# EAGLE design grid1-4 (EAGLE 6.6.0)
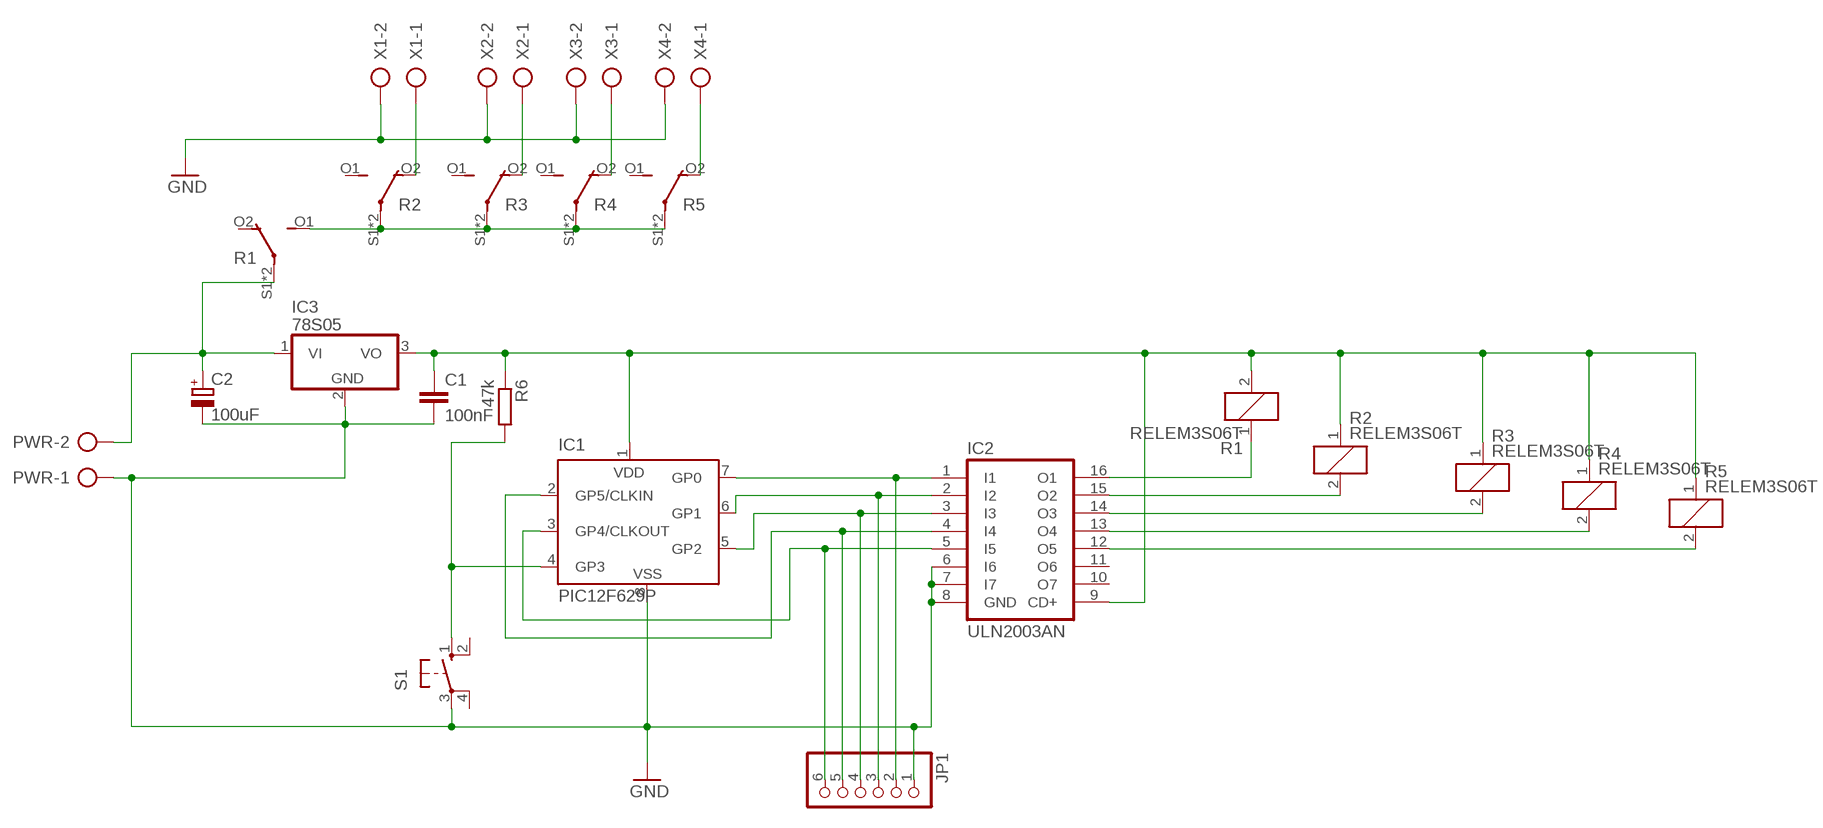
[diagram p0: schematic, sheet 1]

## Parts
C1  100nF  C-EU050-025X075  [C050-025X075]
C2  100uF  CPOL-EUE2.5-6  [E2,5-6]
IC1  PIC12F629P  [DIL8]
IC2  ULN2003AN  [DIL16]
IC3  78S05  7805TV  [TO220V]
JP1  PINHD-1X6  [1X06]
PWR  AK500/2  [AK500/2]
R1  RELEM3S06T  [VIGAN]
R2  RELEM3S06T  [VIGAN]
R3  RELEM3S06T  [VIGAN]
R4  RELEM3S06T  [VIGAN]
R5  RELEM3S06T  [VIGAN]
R6  47k  R-EU_0207/10  [0207/10]
S1  10-XX  [B3F-10XX]
X1  AK500/2  [AK500/2]
X2  AK500/2  [AK500/2]
X3  AK500/2  [AK500/2]
X4  AK500/2  [AK500/2]

## Nets
GND: C1.2 C2.- IC1.8(VSS) IC2.6(I6) IC2.7(I7) IC2.8(GND) IC3.2(GND) JP1.1 PWR.1 S1.3(P) X1.2 X2.2 X3.2 X4.2
MASTER-PW: R1.O1(SW:O-ON) R2.S1(SW:P) R2.S2(SW:P) R3.S1(SW:P) R3.S2(SW:P) R4.S1(SW:P) R4.S2(SW:P) R5.S1(SW:P) R5.S2(SW:P)
N$1: IC1.7(GP0) IC2.1(I1) JP1.2
N$2: IC1.6(GP1) IC2.2(I2) JP1.3
N$3: IC1.5(GP2) IC2.3(I3) JP1.4
N$4: IC1.3(GP4/CLKOUT) IC2.5(I5) JP1.6
N$5: IC1.2(GP5/CLKIN) IC2.4(I4) JP1.5
N$6: IC2.16(O1) R1.1
N$9: IC2.15(O2) R2.2
N$10: IC2.14(O3) R3.2
N$11: IC2.13(O4) R4.2
N$12: IC2.12(O5) R5.2
N$13: IC1.4(GP3) R6.2 S1.1(S)
N$14: R2.O2(SW:O-OFF) X1.1
N$16: R3.O2(SW:O-OFF) X2.1
N$17: R4.O2(SW:O-OFF) X3.1
N$18: R5.O2(SW:O-OFF) X4.1
POW: C2.+ IC3.1(VI) PWR.2 R1.S1(SW:P) R1.S2(SW:P)
VDD: C1.1 IC1.1(VDD) IC2.9(CD+) IC3.3(VO) R1.2 R2.1 R3.1 R4.1 R5.1 R6.1
Unconnected: IC2.10(O7) IC2.11(O6) R1.O2(SW:O-OFF) R2.O1(SW:O-ON) R3.O1(SW:O-ON) R4.O1(SW:O-ON) R5.O1(SW:O-ON) S1.2(S1) S1.4(P1)

## Library data of the parts
C1 = resistor:C-EU: CAPACITOR, European symbol
C2 = rcl:CPOL-EU: POLARIZED CAPACITOR, European symbol
IC1 = microchip:PIC12F6*: Data Sheet 8-Pin FLASH-Based 8-Bit CMOS Microcontrollers Source: http://www.microchip.com .. 41190c.pdf; MF: MICROCHIP; MPN: PIC12F629-I/P; OC_FARNELL: 1292253; OC_NEWARK: 67K0822
IC2 = uln-udn:ULN2003A: DRIVER ARRAY
IC3 = linear:78*: Positive VOLTAGE REGULATOR Source: http://cache.national.com/ds/LM/LM78L05.pdf http://www.fairchildsemi.com/ds/LM/LM7805.pdf
JP1 = pinhead:PINHD-1X6: PIN HEADER
PWR X1-X4 = con-ptr500:AK500/2: CONNECTOR; OC_FARNELL: unknown; OC_NEWARK: unknown
R1-R5 = custom:RELEM3S06T: RELEM3S06T Rele RELEM3S06T, 1 prepinaci kontakt
R6 = resistor:R-EU_: RESISTOR, European symbol
S1 = switch-omron:10-XX: OMRON SWITCH; MPN: B3F-1000; OC_FARNELL: 176432; OC_NEWARK: 36M3542

## Net classes
0 default: clearance 0.205 mm

## Board
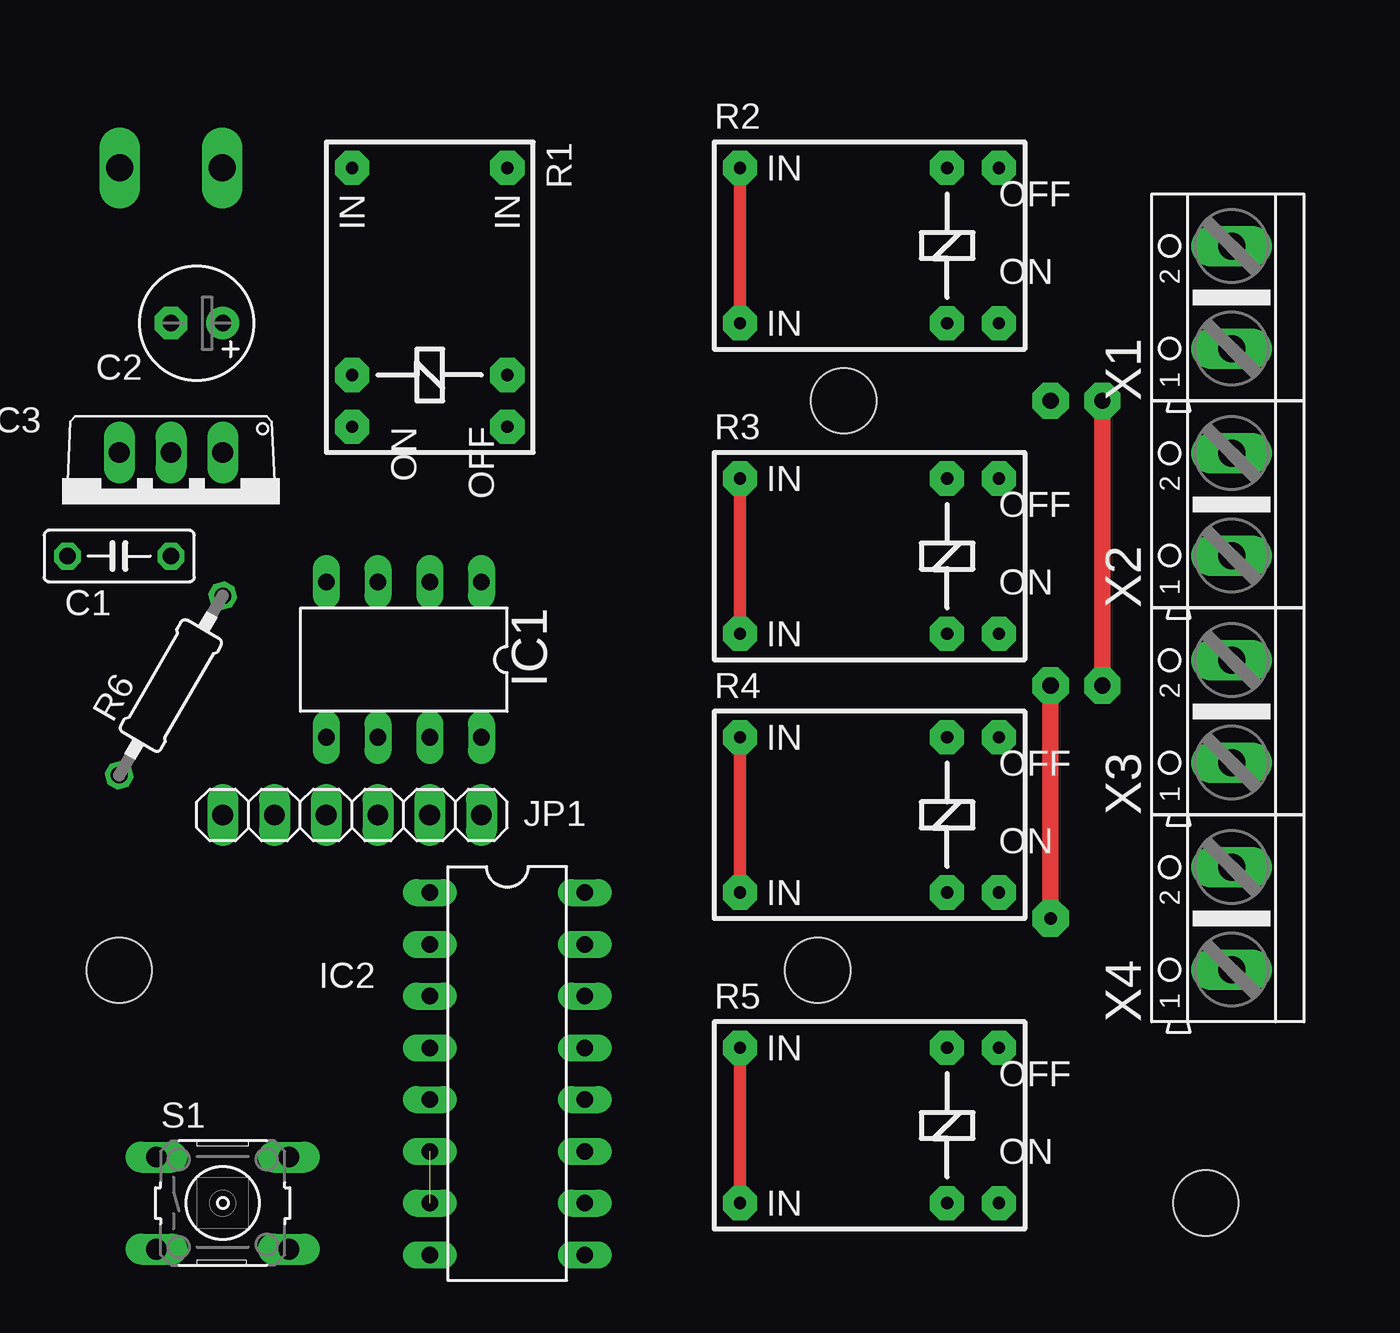
[diagram p1: board, top side]
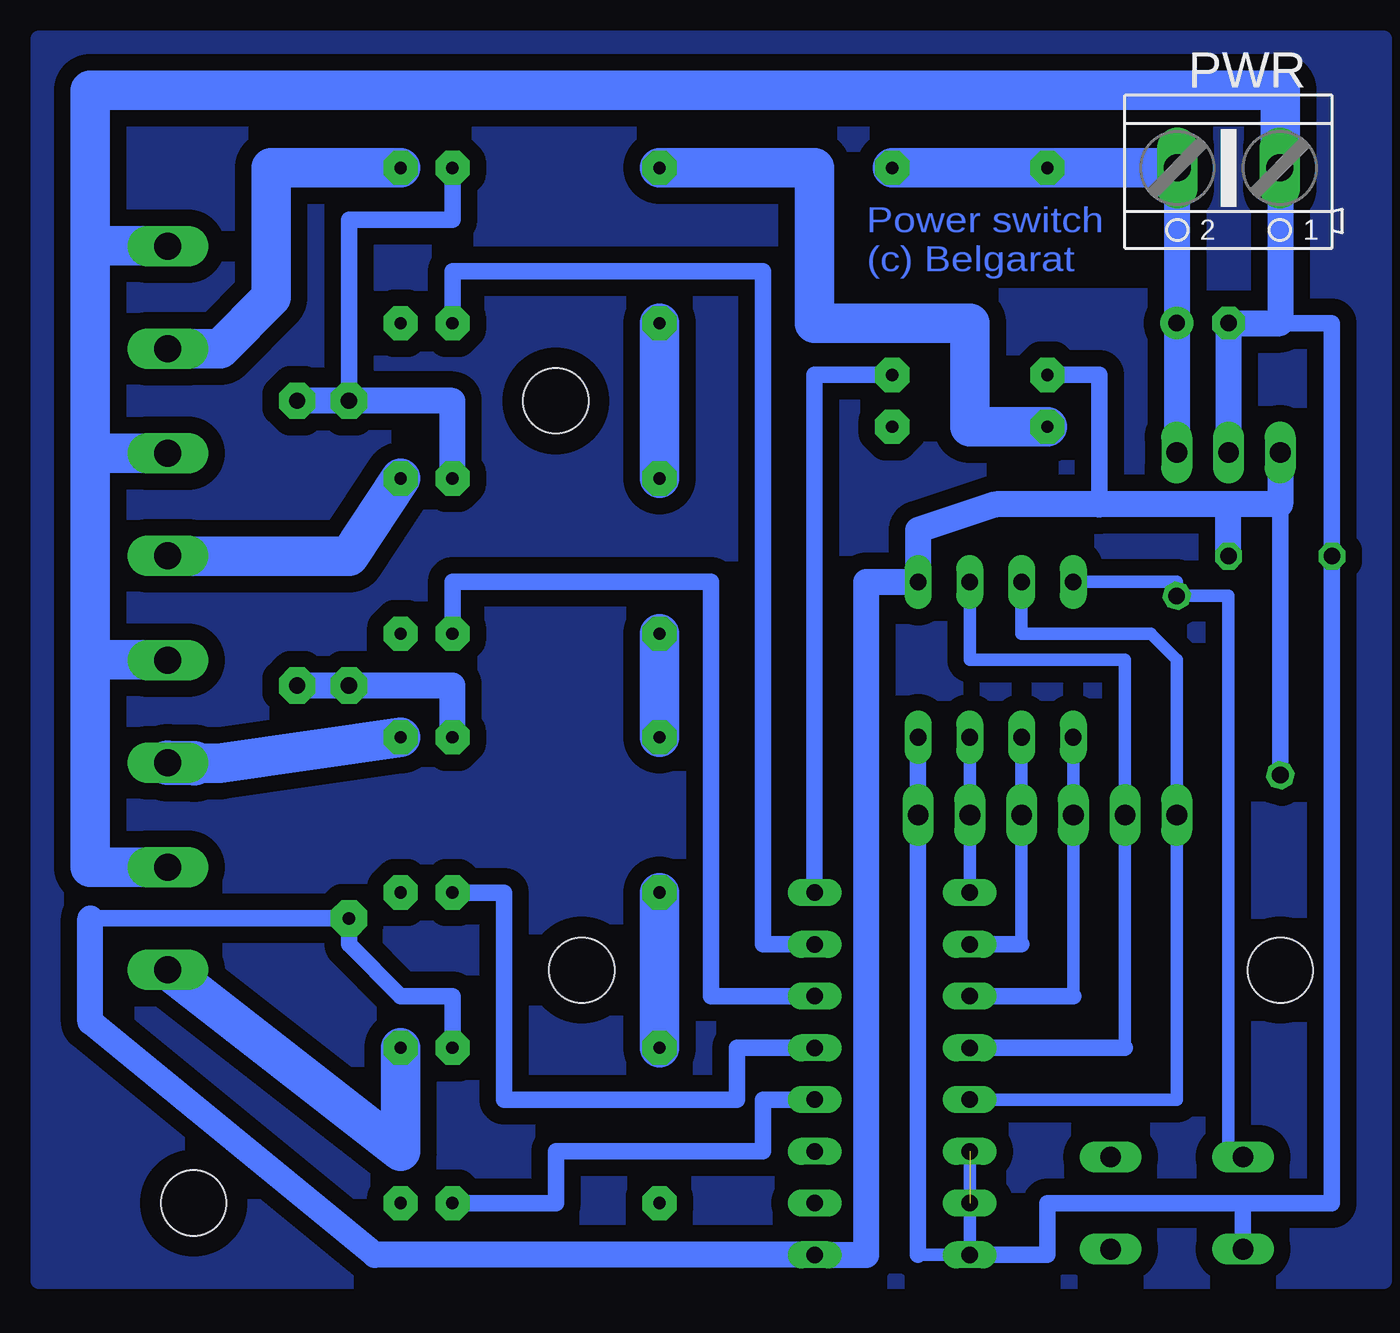
[diagram p2: board, bottom side, seen from below]

No outline drawn. Coordinates in mm, seen from the top.
Copper layers (1*16): Top 0.035mm / dielectric 1.5mm / Bottom 0.035mm
Design rules "default *": minimum track width 10mil, minimum drill 0.6mm, track to track 8mil, track to pad 8mil, pad to pad 8mil, via to via 8mil, smd to smd 8mil, copper to edge 40mil, drill to drill 8mil, minimum pad ring 10mil, minimum via ring 8mil, stop-mask expansion 4mil, vias tented up to drill 0mil, thermal gap 10mil
Holes 3.2 mm at 34.29,31.75 69.85,59.69 68.58,31.75 87.63,20.32

### Footprints (pad centres in the part's own frame; a part is rotated, then mirrored left to right if it is on the bottom)
C050-025X075 = drill 0.813 octagon: 1 -2.54,0; 2 2.54,0
E2,5-6 = drill 0.813 pad 1.6: + -1.27,0 | drill 0.813 pad 1.6 octagon: - 1.27,0
DIL8 = drill 0.813 long: 1 -3.81,-3.81; 2 -1.27,-3.81; 3 1.27,-3.81; 4 3.81,-3.81; 5 3.81,3.81; 6 1.27,3.81; 7 -1.27,3.81; 8 -3.81,3.81
DIL16 = drill 0.813 long: 1 -8.89,-3.81; 2 -6.35,-3.81; 3 -3.81,-3.81; 4 -1.27,-3.81; 5 1.27,-3.81; 6 3.81,-3.81; 7 6.35,-3.81; 8 8.89,-3.81; 9 8.89,3.81; 10 6.35,3.81; 11 3.81,3.81; 12 1.27,3.81; 13 -1.27,3.81; 14 -3.81,3.81; 15 -6.35,3.81; 16 -8.89,3.81
TO220V = drill 1.016 long: 1 -2.54,-2.54; 2 0,-2.54; 3 2.54,-2.54
1X06 = drill 1.016 long: 1 -6.35,0; 2 -3.81,0; 3 -1.27,0; 4 1.27,0; 5 3.81,0; 6 6.35,0
AK500/2 = drill 1.321 long: 1 -2.515,0; 2 2.515,0
VIGAN = drill 0.6 pad 1.676 octagon: 1 1.27,3.81; 2 1.27,-3.81; O1 3.81,-3.81; O2 3.81,3.81; S1 -8.89,3.81; S2 -8.89,-3.81
0207/10 = drill 0.813 octagon: 1 -5.08,0; 2 5.08,0
B3F-10XX = drill 1.016 long: 1 -3.251,2.261; 2 3.251,2.261; 3 -3.251,-2.261; 4 3.251,-2.261

### Placement (x,y rotation side)
C1  34.29,52.07 180 top
C2  38.1,63.5 180 top
IC1  48.26,46.99 180 top
IC2  53.34,26.67 270 top
IC3  36.83,54.61 180 top
JP1  45.72,39.37 180 top
PWR  36.83,71.12 180 bottom
R1  49.53,62.23 270 top
R2  73.66,67.31 0 top
R3  73.66,52.07 0 top
R4  73.66,39.37 0 top
R5  73.66,24.13 0 top
R6  36.83,45.72 60 top
S1  39.37,20.32 0 top
X1  88.9,64.77 90 top
X2  88.9,54.61 90 top
X3  88.9,44.45 90 top
X4  88.9,34.29 90 top

### Tracks (layer width: path | path; a pad name or v marks a point on that pad's centre or on a via)
GND  (1 unrouted)
  Bottom 0.61: 52.07,17.78 IC2.8 IC2.6
  Bottom 0.813: IC1.8 JP1.1 52.07,17.78 | 34.29,63.5 31.75,63.5 C1.2 31.75,20.32 36.12,20.32 | IC2.8 45.72,17.78 45.72,20.32 36.12,20.32 | 36.12,20.32 S1.3 | PWR.1 34.29,71.12
  Bottom 1.016: 88.9,46.99 X3.2 | 88.9,57.15 X2.2 | 88.9,67.31 X1.2
  Bottom 1.27: IC3.2 C2.- 34.29,63.5 34.29,71.12
  Bottom 1.676: X3.2 92.71,46.97 | 92.71,57.15 88.9,57.15
  Bottom 1.93: X4.2 92.71,36.8 92.71,46.99 88.9,46.99 | 92.71,46.97 92.71,57.15 | X2.2 92.71,57.12 92.71,67.31 | 92.71,67.31 92.71,74.93 34.29,74.93 34.29,71.12 | 88.9,67.31 92.71,67.31
MASTER-PW
  Top 0.61: R3.S1 R3.S2 | R2.S1 R2.S2 | R4.S1 R4.S2 | R5.S1 R5.S2
  Bottom 1.93: R2.S2 R3.S1 | R3.S2 R4.S1 | R4.S2 R5.S1 | R1.O1 49.53,58.42 49.53,63.5 57.15,63.5 57.15,71.12 R2.S1
N$1
  Bottom 0.61: IC2.1 JP1.2 IC1.7
N$2
  Bottom 0.61: 46.99,33.02 JP1.3 IC1.6
  Bottom 0.813: 46.99,33.02 IC2.2
N$3
  Bottom 0.61: 44.45,30.48 JP1.4 IC1.5
  Bottom 0.813: 44.45,30.48 IC2.3
N$4
  Bottom 0.61: IC2.5 39.37,25.4 JP1.6 39.37,46.99 40.64,48.26 46.99,48.26 IC1.3
N$5
  Bottom 0.61: 41.91,27.94 JP1.5 41.91,46.99 49.53,46.99 IC1.2
  Bottom 0.813: 41.91,27.94 IC2.4
N$6
  Bottom 0.813: IC2.16 57.15,60.96 R1.1
N$9
  Bottom 0.813: IC2.15 59.69,33.02 59.69,66.04 74.93,66.04 R2.2
N$10
  Bottom 0.813: IC2.14 62.23,30.48 62.23,50.8 74.93,50.8 R3.2
N$11
  Bottom 0.813: IC2.13 60.96,27.94 60.96,25.4 72.39,25.4 72.39,35.56 R4.2
N$12
  Bottom 0.813: IC2.12 59.69,25.4 59.69,22.86 69.85,22.86 69.85,20.32 R5.2
N$13
  Bottom 0.61: 36.83,22.58 36.83,50.12 R6.2 39.37,50.8 IC1.4
  Bottom 0.813: S1.1 36.83,22.58
N$14
  Bottom 1.93: X1.1 86.33,62.26 83.82,64.77 83.82,71.12 R2.O2
N$16
  Bottom 1.93: R3.O2 80.01,52.07 87.61,52.07 X2.1
N$17
  Bottom 1.93: R4.O2 86.36,41.91 87.61,41.91
  Bottom 2.184: 87.61,41.91 X3.1
N$18
  Bottom 1.93: R5.O2 77.47,22.86 X4.1
N$19
  pour Bottom (isolate 0.813, no thermals): 29.21,77.47 95.25,77.47 95.25,16.51 29.21,16.51
POW
  Bottom 0.813: PWR.2 39.37,69.85
  Bottom 1.27: 39.37,69.85 C2.+ IC3.1
  Bottom 1.93: PWR.2 R1.S2 R1.S1
VDD  (via drill 0.6 pad 1.78, 0.8 pad 1.78)
  Top 0.813: v82.55,45.72 v82.55,59.69 | v80.01,34.29 v80.01,45.72
  Bottom 0.813: R5.1 74.93,30.48 77.47,30.48 80.01,33.02 v80.01,34.29 92.71,34.29 | 34.29,54.61 R6.1 | R1.2 43.18,60.96 43.18,54.61 | R2.1 74.93,68.58 80.01,68.58 v80.01,59.69
  Bottom 1.27: R4.1 74.93,45.72 v80.01,45.72 v82.55,45.72 | v82.55,59.69 v80.01,59.69 74.93,59.69 R3.1 | 92.71,34.29 92.71,29.21 78.74,17.78 IC2.9 54.61,17.78 54.61,50.8 IC1.1 52.07,53.34 48.26,54.61 43.18,54.61 36.83,54.61 | IC3.3 34.29,54.61 36.83,54.61 | C1.1 36.83,54.61

### Text on the board
Bottom: Power switch / (c) Belgarat